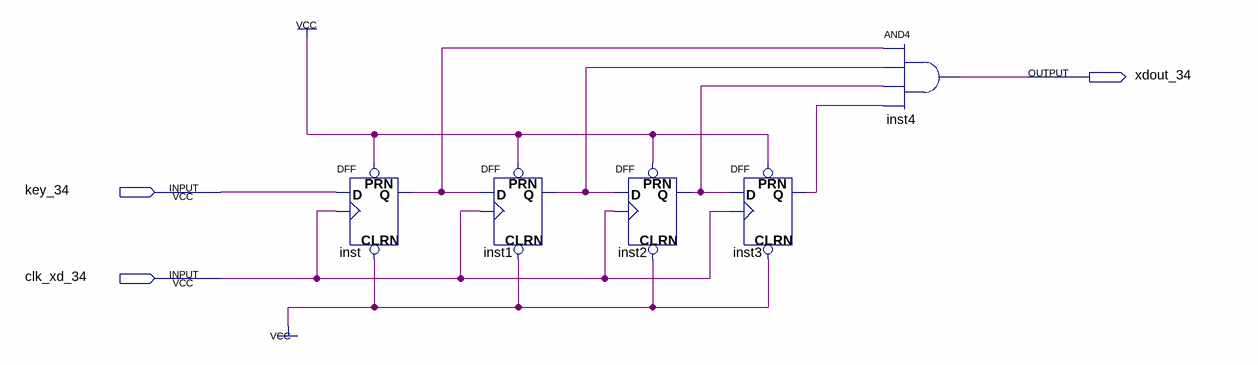
[diagram p0: schematic sheet]
// Quartus schematic xd_34.bdf as structural Verilog: 5 symbols, 3 pins
module xd_34 (
  input  key_34,
  input  clk_xd_34,
  output xdout_34
);

  wire inst1_q, inst2_q, inst3_q, inst_q;

  DFF inst (.CLRN(1'b1), .CLK(clk_xd_34), .D(key_34), .PRN(1'b1), .Q(inst_q));
  DFF inst1 (.CLRN(1'b1), .CLK(clk_xd_34), .D(inst_q), .PRN(1'b1), .Q(inst1_q));
  DFF inst2 (.CLRN(1'b1), .CLK(clk_xd_34), .D(inst1_q), .PRN(1'b1), .Q(inst2_q));
  DFF inst3 (.CLRN(1'b1), .CLK(clk_xd_34), .D(inst2_q), .PRN(1'b1), .Q(inst3_q));
  and inst4 (xdout_34, inst_q, inst1_q, inst2_q, inst3_q);
endmodule
